# EAGLE design merged_pots (EAGLE 5.07)
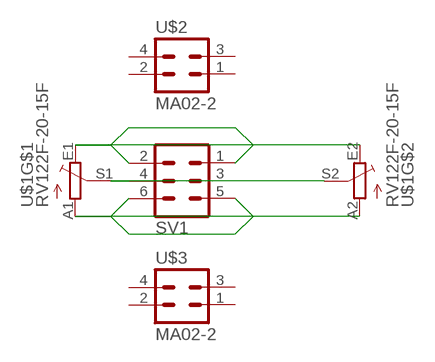
[diagram p0: schematic, sheet 1]

## Parts
SV1  MA03-2  [MA03-2]
U$1  RV122F-20-15F  [RV122F-20-15F]
U$2  MA02-2  [MA02-2]
U$3  MA02-2  [MA02-2]

## Nets
N$1: SV1.3 SV1.4 U$1.S1(S) U$1.S2(S)
N$2: SV1.1 SV1.2 U$1.E1(E) U$1.E2(E)
N$3: SV1.5 SV1.6 U$1.A1(A) U$1.A2(A)
Unconnected: U$2.1 U$2.2 U$2.3 U$2.4 U$3.1 U$3.2 U$3.3 U$3.4

## Library data of the parts
SV1 = joakim:MA03-2: PIN HEADER
U$1 = joakim:RV122F-20-15F: Alpha 12mm potentiometer - RV122F-20-15F
U$2 U$3 = joakim:MA02-2: PIN HEADER

## Board
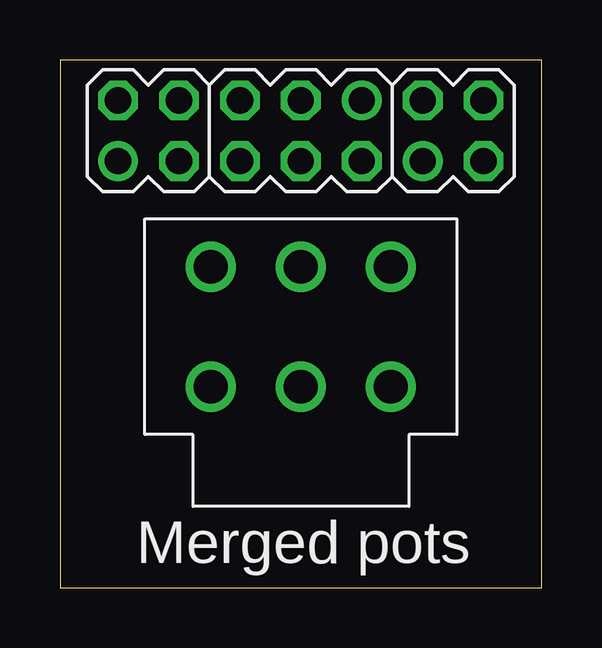
[diagram p1: board, top side]
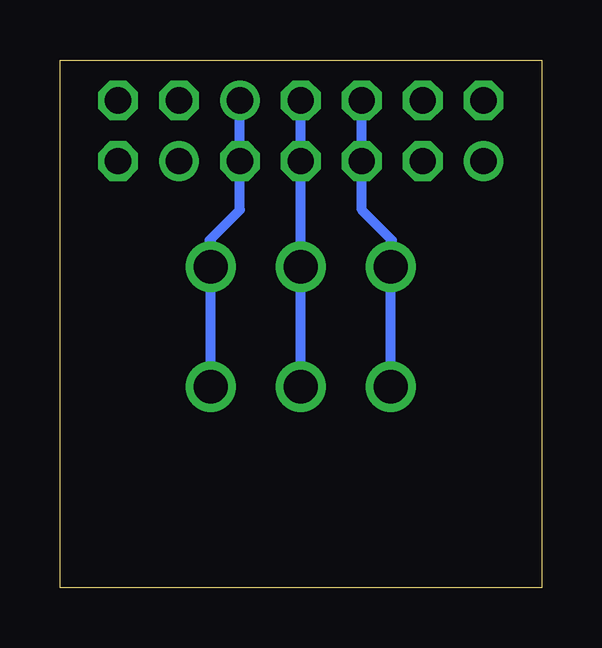
[diagram p2: board, bottom side, seen from below]

Size 20.07 x 22 mm. Coordinates in mm from the lower left corner, seen from the top.
Outline: 0,0 20.07,0 20.07,22 0,22 0,0
Copper layers (1*16): Top 0.035mm / dielectric 1.5mm / Bottom 0.035mm
Design rules "8mils": minimum track width 8mil, minimum drill 0.6mm, track to track 8mil, track to pad 8mil, pad to pad 8mil, via to via 8mil, smd to smd 0mil, copper to edge 20mil, drill to drill 10mil, minimum pad ring 8mil, minimum via ring 8mil, stop-mask expansion 0mil, vias tented up to drill 0mil, thermal gap 10mil

### Footprints (pad centres in the part's own frame; a part is rotated, then mirrored left to right if it is on the bottom)
MA03-2 = drill 1.1 round: 1 -2.54,-1.27 | drill 1.1 octagon: 2 -2.54,1.27; 3 0,-1.27; 4 0,1.27; 5 2.54,-1.27; 6 2.54,1.27
RV122F-20-15F = drill 1.4 round: A1 -3.75,5; A2 -3.75,0; E1 3.75,5; E2 3.75,0; S1 0,5; S2 0,0
MA02-2 = drill 1.1 round: 1 -1.27,-1.27 | drill 1.1 octagon: 2 -1.27,1.27; 3 1.27,-1.27; 4 1.27,1.27

### Placement (x,y rotation side)
SV1  10.03,19.05 180 top
U$1  10.03,8.38 0 top
U$2  3.68,19.05 0 top
U$3  16.38,19.05 0 top

### Tracks (layer width: path | path; a pad name or v marks a point on that pad's centre or on a via)
N$1
  Bottom 0.406: U$1.S2 U$1.S1 SV1.4 SV1.3
N$2
  Bottom 0.406: U$1.E2 U$1.E1 13.78,14.42 13.84,14.48 12.57,15.75 SV1.2 SV1.1
N$3
  Bottom 0.406: U$1.A2 U$1.A1 6.28,14.42 6.22,14.48 7.49,15.75 SV1.6 SV1.5

### Text on the board
tPlace: Merged pots